# EAGLE design schemat (EAGLE 9.6.2)
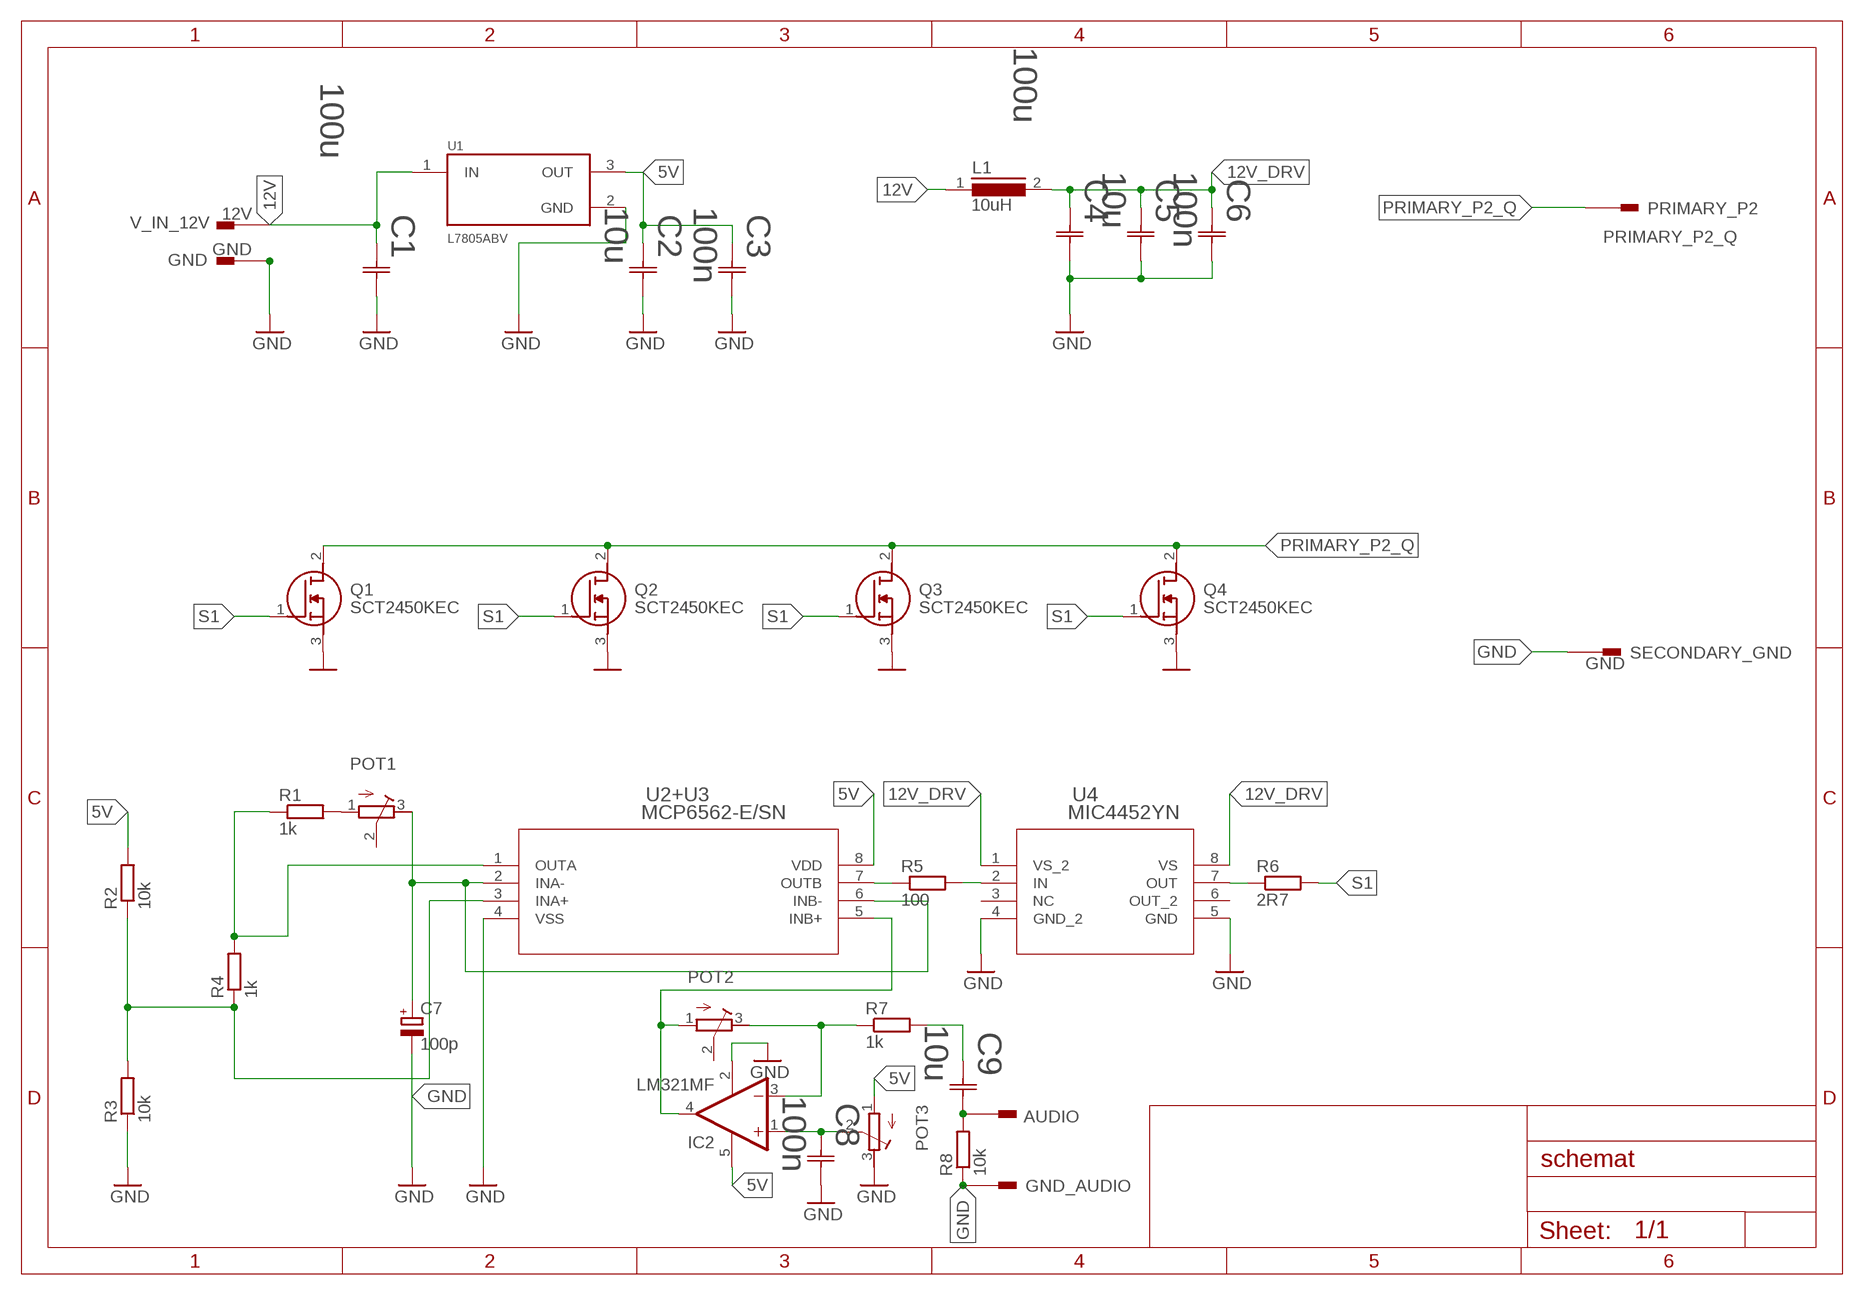
[diagram p0: schematic, sheet 1]

## Parts
AUDIO  PIN1-2  [62221]
C1  100u  35ZLH100MEFC6.3X11  [CAP_YX_6P3X11_RUB]
C2  10u  ECEA1EKS100  [CAP_5_X_5_PAN]
C3  100n  0402B104K250CT  [CAP_0402_WAL]
C4  100u  35ZLH100MEFC6.3X11  [CAP_YX_6P3X11_RUB]
C5  10u  ECEA1EKS100  [CAP_5_X_5_PAN]
C6  100n  0402B104K250CT  [CAP_0402_WAL]
C7  100p  CPOL-EUE1.8-4  [E1,8-4]
C8  100n  0402B104K250CT  [CAP_0402_WAL]
C9  10u  ECEA1EKS100  [CAP_5_X_5_PAN]
GND  GND  PIN1-2  [62221]
GND_AUDIO  GND  PIN1-2  [62221]
IC2  LM321MF  [SOT23-5]
L1  10uH  RKE4  [RKE4]
POT1  R-TRIMM64W  [RTRIM64W]
POT2  R-TRIMM64W  [RTRIM64W]
POT3  R-TRIMM64W  [RTRIM64W]
PRIMARY_P2  PRIMARY_P2_Q  PIN1-2  [62221]
Q1  SCT2450KEC  [TO545P521X1594X2583-3P]
Q2  SCT2450KEC  [TO545P521X1594X2583-3P]
Q3  SCT2450KEC  [TO545P521X1594X2583-3P]
Q4  SCT2450KEC  [TO545P521X1594X2583-3P]
R1  1k  R-EU_0204/7  [0204/7]
R2  10k  R-EU_0204/7  [0204/7]
R3  10k  R-EU_0204/7  [0204/7]
R4  1k  R-EU_0204/7  [0204/7]
R5  100  R-EU_0204/7  [0204/7]
R6  2R7  R-EU_0204/7  [0204/7]
R7  1k  R-EU_0204/7  [0204/7]
R8  10k  R-EU_0204/7  [0204/7]
SECONDARY_GND  GND  PIN1-2  [62221]
U1  L7805ABV  [TO254P460X1020X1945-3P]
U2+U3  MCP6562-E/SN  [SOIC8-N_MC_MCH]
U4  MIC4452YN  [PDIP8(N)_MCH]
V_IN_12V  12V  PIN1-2  [62221]

## Nets
5V: C2.1 C3.1 IC2.5(V+) POT3.1(A) R2.2 U1.3(OUT) U2+U3.8(VDD)
12V: C1.1 L1.1 U1.1(IN) V_IN_12V.1
12V_DRV: C4.1 C5.1 C6.1 L1.2 U4.1(VS_2) U4.8(VS)
12V_DRV1: C8.1 IC2.1(+IN) POT3.2(S)
GND: C1.2 C2.2 C3.2 C4.2 C5.2 C6.2 C7.- C8.2 GND.1 GND_AUDIO.1 IC2.2(V-) POT3.3(E) Q1.3(S) Q2.3(S) Q3.3(S) Q4.3(S) R3.1 R8.1 SECONDARY_GND.1 U1.2(GND) U2+U3.4(VSS) U4.4(GND_2) U4.5(GND)
N$1: R2.1 R3.2 R4.1 U2+U3.3(INA+)
N$2: R1.1 R4.2 U2+U3.1(OUTA)
N$3: POT1.1(A) R1.2
N$4: C7.+ POT1.3(E) U2+U3.2(INA-) U2+U3.6(INB-)
N$5: R5.1 U2+U3.7(OUTB)
N$6: R5.2 U4.2(IN)
N$7: R6.1 U4.7(OUT)
N$8: IC2.4(OUT) POT2.1(A) U2+U3.5(INB+)
N$9: C9.1 R7.2
N$10: IC2.3(-IN) POT2.3(E) R7.1
N$11: AUDIO.1 C9.2 R8.2
PRIMARY_P2_Q: PRIMARY_P2.1 Q1.2(D) Q2.2(D) Q3.2(D) Q4.2(D)
S1: Q1.1(G) Q2.1(G) Q3.1(G) Q4.1(G) R6.2
Unconnected: POT1.2(S) POT2.2(S) U4.3(NC) U4.6(OUT_2)

## Library data of the parts
AUDIO GND GND_AUDIO PRIMARY_P2 SECONDARY_GND V_IN_12V = con-faston:PIN1-2: CONN TAB FASTON BRASS .187 PCB TAB, FSSTON, DUAL STAKE, .187 SERIES Digi-Key Part Number: A24734CT-ND Source: Tyco Electronics Corporation .. ENG_CD_62221_R.pdf http://search.digikey.com/scripts/DkSearch/dksus.dll?Detail&name=A24734CT-ND; MF: TYCO ELECTRONICS; MPN: 62221-1; OC_FARNELL: unknown; OC_NEWARK: 16H2318
C1 C4 = 6_3x11:35ZLH100MEFC6.3X11; COPYRIGHT: Copyright (C) 2024 Ultra Librarian. All rights reserved.; MANUFACTURER_PART_NUMBER: 35ZLH100MEFC6.3X11; MFR_NAME: Rubycon
C2 C5 C9 = 10u:ECEA1EKS100; COPYRIGHT: Copyright (C) 2024 Ultra Librarian. All rights reserved.; MANUFACTURER_PART_NUMBER: ECEA1EKS100; MFR_NAME: Panasonic
C3 C6 C8 = 100n:0402B104K250CT; COPYRIGHT: Copyright (C) 2024 Ultra Librarian. All rights reserved.; MANUFACTURER_PART_NUMBER: 0402B104K250CT; MFR_NAME: Walsin
C7 = rcl:CPOL-EU: POLARIZED CAPACITOR, European symbol; SPICEPREFIX: C
IC2 = linear:LM321?*: Low Power Single Op Amp Source: http://cache.national.com/ds/LM/LM321.pdf
L1 = inductors:RKE4: INDUCTOR; SPICEPREFIX: L
POT1-POT3 = rcl:R-TRIMM: Trimm resistor; SPICEMODEL: X; SPICEPREFIXL: POT
Q1-Q4 = SCT2450KEC:SCT2450KEC: ROHM SCT2450KEC N-channel MOSFET Transistor, 10 A, 1200 V, 3-Pin TO-247 Source: Datasheet <https://datasheet.datasheetarchive.com/originals/distributors/Datasheets_SAMA/98bdb544f590089e014c21aaa2b32b5b.pdf>; DESCRIPTION: ROHM SCT2450KEC N-channel MOSFET Transistor, 10 A, 1200 V, 3-Pin TO-247; HEIGHT: 5.21mm; MANUFACTURER_NAME: ROHM Semiconductor; MANUFACTURER_PART_NUMBER: SCT2450KEC
R1-R8 = rcl:R-EU_: RESISTOR, European symbol; SPICEPREFIX: R
U1 = L7805ABV:L7805ABV: L7805 Series 1.5 A 5 V Three Terminal Voltage Regulator - TO-220 Check availability <https://pricing.snapeda.com/parts/L7805ABV/STMicroelectronics/view-part?ref=eda>; AVAILABILITY: In Stock; CHECK_PRICES: https://www.snapeda.com/parts/L7805ABV/STMicroelectronics/view-part/?ref=eda; DESCRIPTION: Linear Voltage Regulator IC Positive Fixed 1 Output 1.5A TO-220; MF: STMicroelectronics; MP: L7805ABV; PACKAGE: TO-220-3 STMicroelectronics; PRICE: None; PURCHASE-URL: https://www.snapeda.com/api/url_track_click_mouser/?unipart_id=4685&manufacturer=STMicroelectronics&part_name=L7805ABV&search_term=None; SNAPEDA_LINK: https://www.snapeda.com/parts/L7805ABV/STMicroelectronics/view-part/?ref=snap
U2+U3 = MCP6562-E_SN:MCP6562-E/SN; COPYRIGHT: Copyright (C) 2024 Ultra Librarian. All rights reserved.; MANUFACTURER_PART_NUMBER: mcp6562-e/sn; MFR_NAME: Microchip
U4 = MIC4452YN:MIC4452YN; COPYRIGHT: Copyright (C) 2024 Ultra Librarian. All rights reserved.; MANUFACTURER_PART_NUMBER: MIC4452YN; MFR_NAME: Micrel / Microchip Technology

## Board
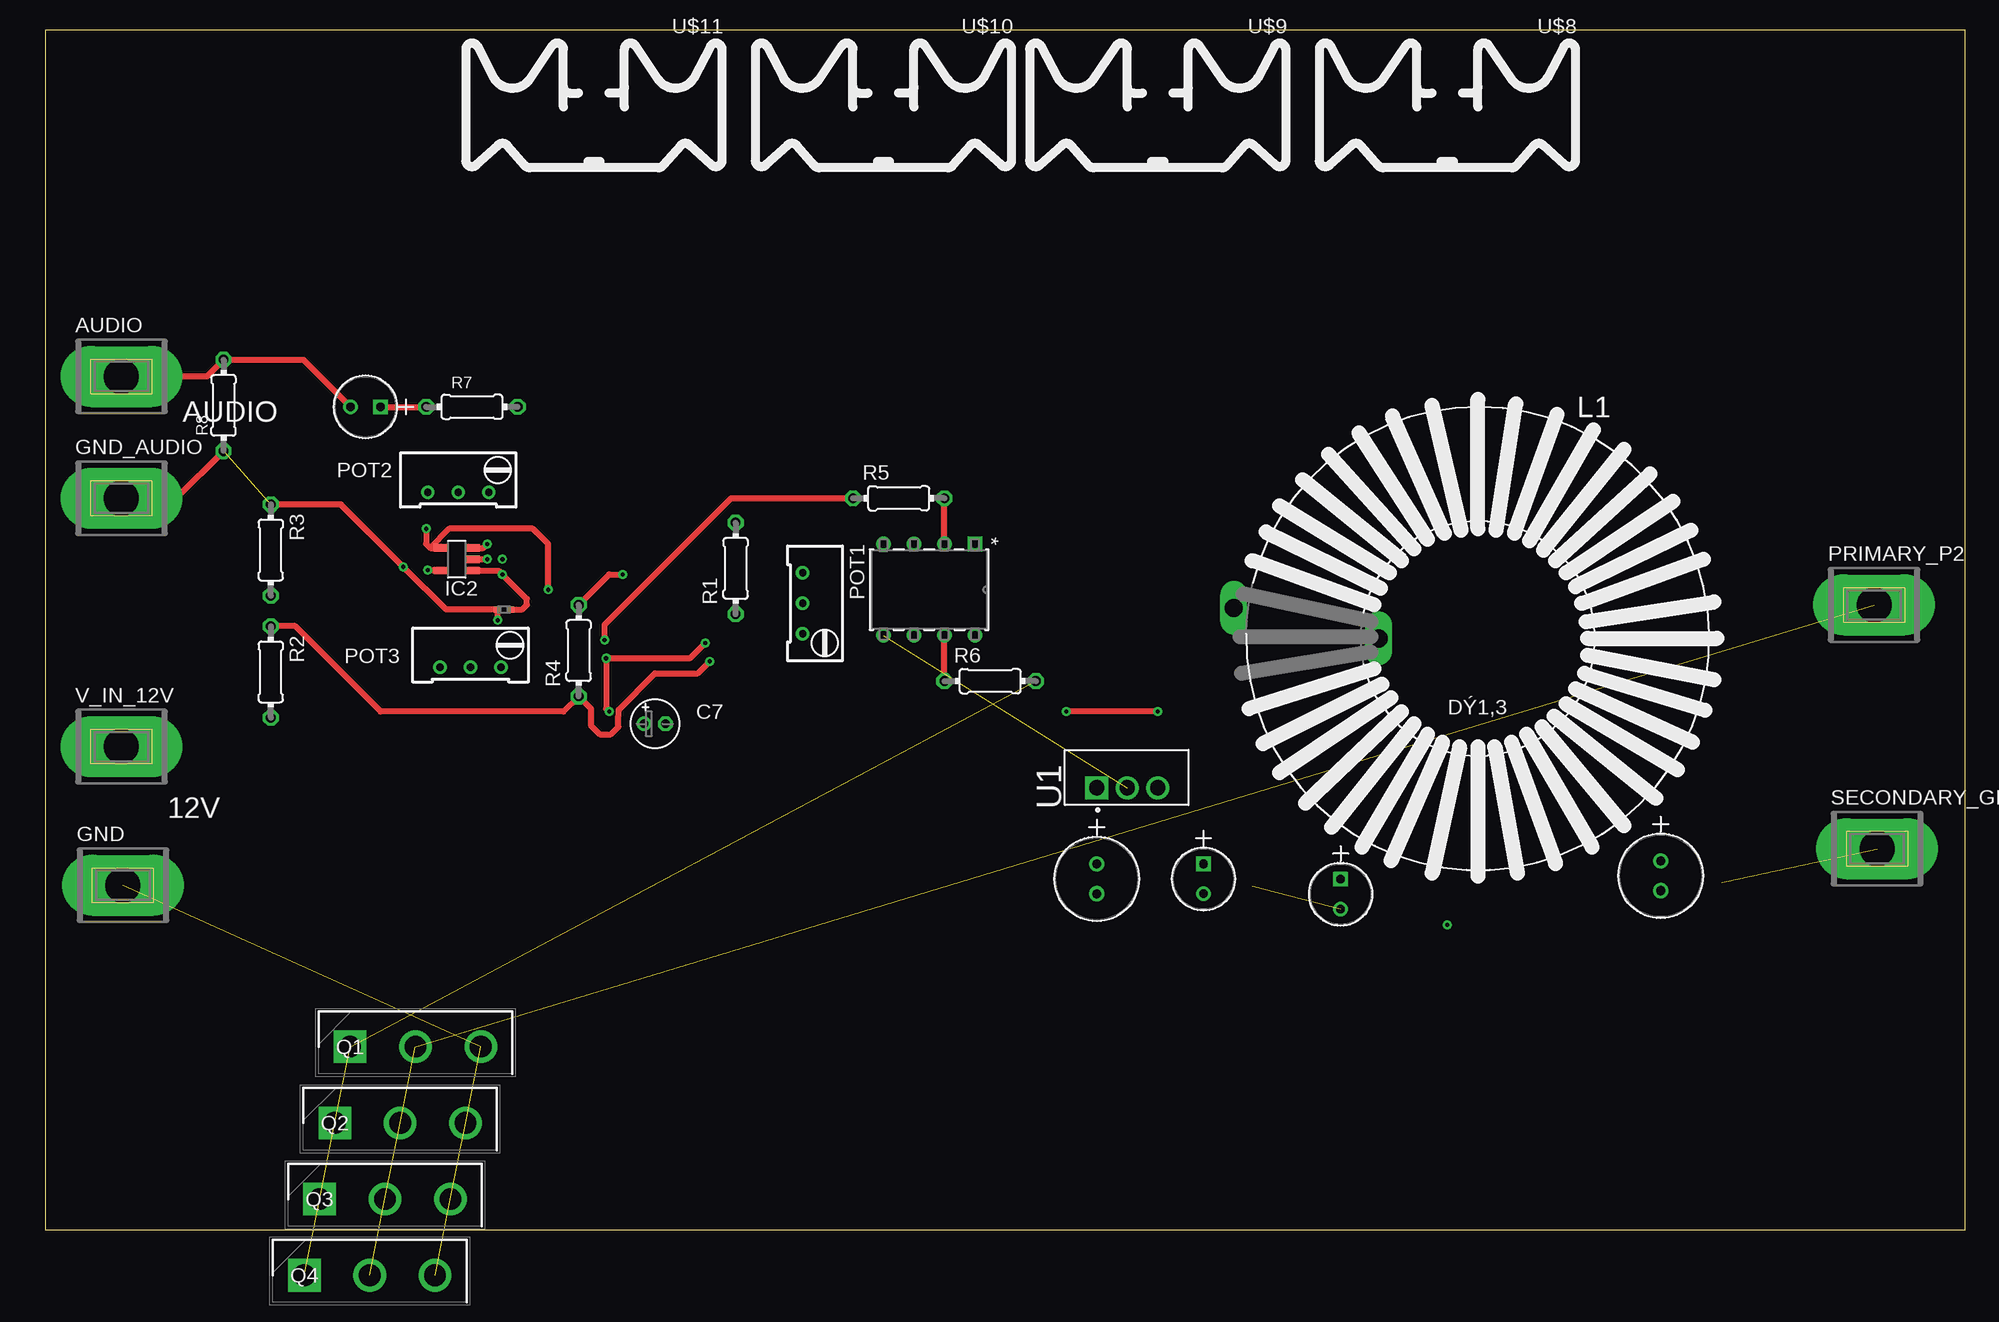
[diagram p1: board, top side]
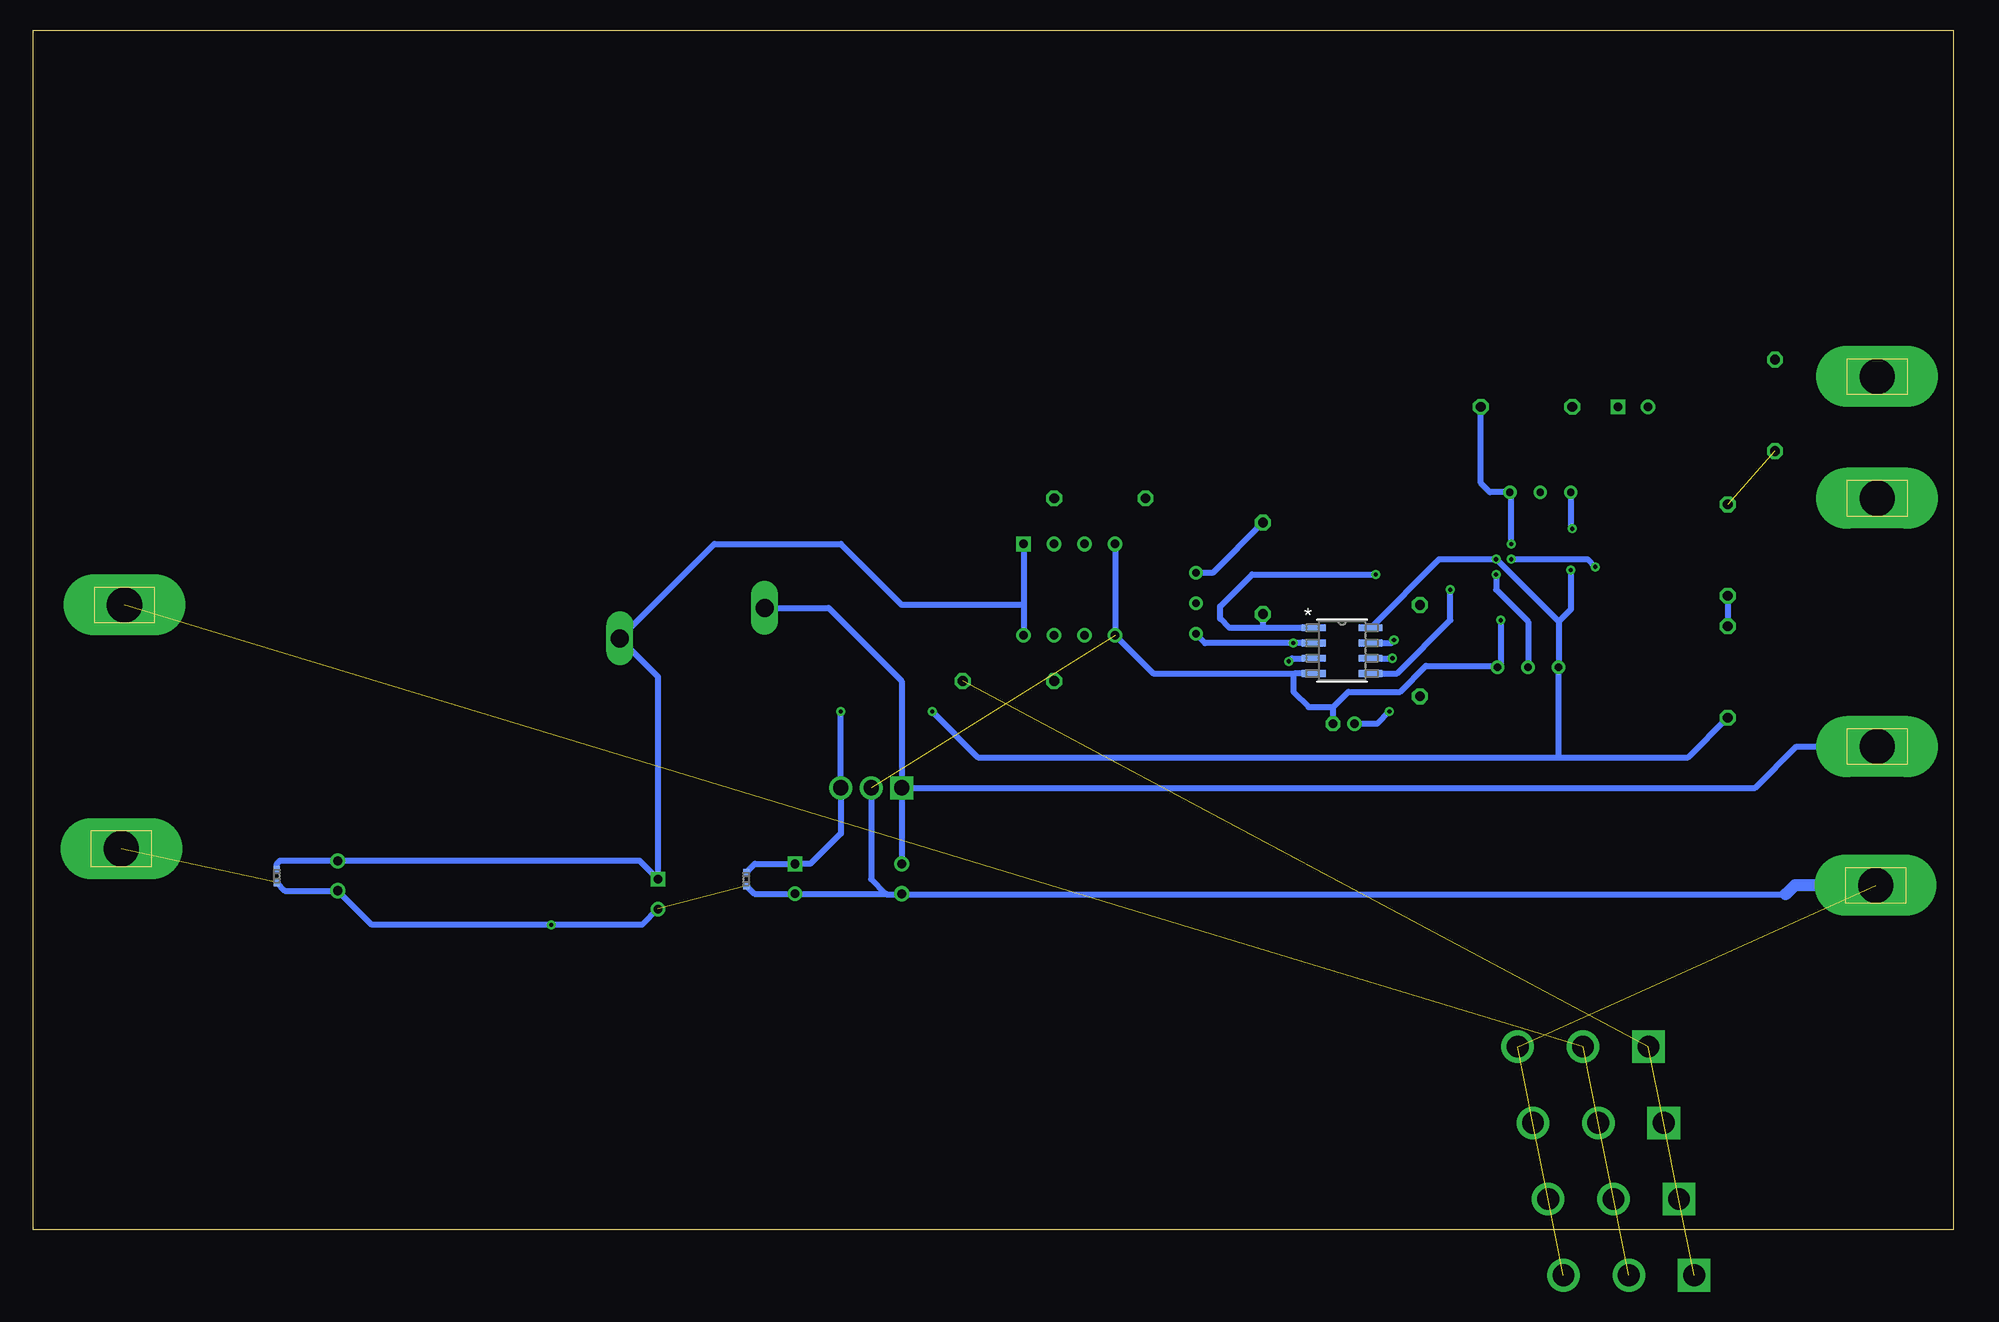
[diagram p2: board, bottom side, seen from below]

Size 160 x 100 mm. Coordinates in mm from the lower left corner, seen from the top.
Outline: 0,0 160,0 160,100 0,100 0,0
Copper layers (1*16): Top 0.035mm / dielectric 1.5mm / Bottom 0.035mm
Design rules "default": minimum track width 6mil, minimum drill 0.35mm, track to track 6mil, track to pad 6mil, pad to pad 6mil, via to via 6mil, smd to smd 6mil, copper to edge 40mil, drill to drill 6mil, minimum pad ring 10mil, minimum via ring 8mil, stop-mask expansion 4mil, vias tented up to drill 0mil, thermal gap 10mil

### Footprints (pad centres in the part's own frame; a part is rotated, then mirrored left to right if it is on the bottom)
62221 = drill 2.921 pad 5.08 long: 1 0,0
CAP_YX_6P3X11_RUB = drill 0.762 pad 1.27: 1 0,0; 2 2.489,0
CAP_5_X_5_PAN = drill 0.711 pad 1.219 square: 1 0,0 | drill 0.711 pad 1.219: 2 2.489,0
CAP_0402_WAL = smd 0.61 x 0.508: 1 -0.546,0; 2 0.546,0
E1,8-4 = drill 0.711 pad 1.168: + -0.889,0 | drill 0.711 pad 1.168 octagon: - 0.889,0
SOT23-5 = smd 0.6 x 1.2: 1 -0.95,-1.306; 2 0,-1.306; 3 0.95,-1.306; 4 0.95,1.306; 5 -0.95,1.306
RKE4 = drill 1.499 long: 1 -20.32,2.54; 2 -8.255,0
RTRIM64W = drill 0.61: 1 1.27,-2.54; 2 1.27,0; 3 1.27,2.54
TO545P521X1594X2583-3P = drill 1.81 pad 2.715 square: 1 0,0 | drill 1.81 pad 2.715: 2 5.45,0; 3 10.9,0
0204/7 = drill 0.813 octagon: 1 -3.81,0; 2 3.81,0
TO254P460X1020X1945-3P = drill 1.27 pad 1.91 square: 1 0,2.54 | drill 1.27 pad 1.91: 2 0,0; 3 0,-2.54
SOIC8-N_MC_MCH = smd 1.981 x 0.559: 1 -2.362,1.905; 2 -2.362,0.635; 3 -2.362,-0.635; 4 -2.362,-1.905; 5 2.362,-1.905; 6 2.362,-0.635; 7 2.362,0.635; 8 2.362,1.905
PDIP8(N)_MCH = drill 0.711 pad 1.219 square: 1 0,0 | drill 0.711 pad 1.219: 2 0,-2.54; 3 0,-5.08; 4 0,-7.62; 5 7.62,-7.62; 6 7.62,-5.08; 7 7.62,-2.54; 8 7.62,0

### Placement (x,y rotation side)
AUDIO  6.35,71.12 0 top
C1  87.63,30.48 270 top
C2  96.52,30.48 270 top
C3  100.58,29.21 270 bottom
C4  134.62,30.73 270 top
C5  107.95,29.21 270 top
C6  139.7,29.46 270 bottom
C7  50.8,42.16 0 top
C8  38.23,51.69 180 top
C9  27.94,68.58 180 top
GND  6.48,28.7 0 top
GND_AUDIO  6.35,60.96 0 top
IC2  34.29,55.88 90 top
L1  119.38,49.28 0 top
POT1  64.39,52.2 180 top
POT2  34.42,62.74 270 top
POT3  35.43,48.13 270 top
PRIMARY_P2  152.4,52.07 0 top
Q1  25.4,15.24 0 top
Q2  24.13,8.89 0 top
Q3  22.86,2.54 0 top
Q4  21.59,-3.81 0 top  (outside the outline)
R1  57.53,55.12 90 top
R2  18.8,46.48 270 top
R3  18.8,56.64 270 top
R4  44.45,48.26 90 top
R5  71.12,60.96 0 top
R6  78.74,45.72 0 top
R7  35.56,68.58 180 top
R8  14.86,68.71 90 top
SECONDARY_GND  152.65,31.75 0 top
U1  90.17,36.83 90 top
U2+U3  50.93,48.26 0 bottom
U4  77.47,57.15 270 top
U$8  [PF752]  116.84,88.9 180 top
U$9  [PF752]  92.71,88.9 180 top
U$10  [PF752]  69.85,88.9 180 top
U$11  [PF752]  45.72,88.9 180 top
V_IN_12V  6.35,40.26 0 top

### Tracks (layer width: path | path; a pad name or v marks a point on that pad's centre or on a via)
5V  (via drill 0.35)
  Top 0.508: v92.71,43.18 v85.09,43.18 | IC2.5 31.94,54.93 v31.88,54.99
  Bottom 0.508: C3.1 99.86,30.48 C2.1 95.25,30.48 92.71,33.02 U1.3 v92.71,43.18 | v85.09,43.18 81.28,39.37 33.02,39.37 | R2.2 22.1,39.37 33.02,39.37 | 32.89,50.67 POT3.1 32.89,39.5 33.02,39.37 | 32.89,50.67 v38.1,55.88 42.85,55.88 U2+U3.8 | v31.88,54.99 31.88,51.69 32.89,50.67
12V
  Bottom 0.508: L1.1 93.73,51.82 87.63,45.72 U1.1 | U1.1 16.51,36.83 13.08,40.26 V_IN_12V.1 | U1.1 C1.1
12V_DRV
  Bottom 0.508: U4.1 77.47,52.07 | 77.47,52.07 U4.8 | 77.47,52.07 87.63,52.07 92.71,57.15 103.25,57.15 L1.2 107.95,46.1 C5.1 109.47,30.73 C4.1 139.45,30.73 139.7,30.48 C6.1
12V_DRV1  (via drill 0.35)
  Top 0.508: IC2.1 37.78,54.93 v38.1,54.61 40.13,52.58 40.13,52.07 39.75,51.69 C8.1
  Bottom 0.508: v38.1,54.61 38.1,53.34 35.43,50.67 POT3.2
GND  (via drill 0.35)  (8 unrouted)
  Top 0.508: R8.1 10.92,60.96 GND_AUDIO.1 | R3.1 24.64,60.45 v29.84,55.24 33.4,51.69 C8.2 37.68,50.84 v37.72,50.8 | IC2.2 v36.83,55.88
  Bottom 0.508: 13.97,27.94 87.58,27.94 88.9,27.94 88.95,27.99 | U1.2 90.17,29.21 88.95,27.99 | 88.95,27.99 C2.2 99.91,27.99 C3.2 | U4.4 U4.5 66.67,46.35 54.86,46.35 | C6.2 139.03,28.25 C4.2 131.78,25.4 v116.84,25.4 109.27,25.4 C5.2 | v37.72,50.8 37.72,47.12 POT3.3 38.1,46.99 43.94,46.99 46.1,44.83 50.42,44.83 51.69,43.56 | U2+U3.4 54.86,46.35 | 54.86,46.35 54.99,46.23 54.99,44.83 53.72,43.56 51.69,43.56 | C7.- 51.69,43.56 | v29.84,55.24 30.48,55.88 v36.83,55.88
  Bottom 1.016: GND.1 13.21,28.7 13.97,27.94 | 87.58,27.94 C1.2
N$1  (via drill 0.35)
  Top 0.508: R2.1 20.83,50.29 27.94,43.18 43.18,43.18 R4.1 45.47,43.43 45.47,42.04 46.23,41.27 47.12,41.27 47.75,41.91 47.75,42.83 47.77,42.85 47.77,43.33 50.8,46.35 54.36,46.35 v55.37,47.37
  Bottom 0.508: R3.2 R2.1 | v55.37,47.37 55.12,47.62 U2+U3.3
N$2  (via drill 0.35)
  Top 0.508: R4.2 46.99,54.61 v48.13,54.61
  Bottom 0.508: U2+U3.1 57.53,50.16 | 57.53,50.16 60.33,50.16 61.09,50.93 61.09,51.94 58.42,54.61 v48.13,54.61 | R1.1 57.53,50.16
N$3
  Bottom 0.508: R1.2 61.72,54.74 POT1.1
N$4  (via drill 0.35)
  Top 0.508: v46.99,43.18 46.74,43.43 v46.74,47.62 53.72,47.62 v54.99,48.9
  Bottom 0.508: U2+U3.6 v46.74,47.62 | v46.99,43.18 48.01,42.16 C7.+ | U2+U3.2 v54.99,48.9 62.36,48.9 POT1.3
N$5  (via drill 0.35)
  Top 0.508: v46.61,49.15 46.61,50.42 57.15,60.96 R5.1
  Bottom 0.508: U2+U3.7 46.86,48.9 v46.61,49.15
N$6
  Top 0.508: U4.2 R5.2
N$7
  Top 0.508: R6.1 U4.7
N$8  (via drill 0.35)
  Top 0.508: v31.75,58.42 31.75,57.15 32.07,56.83 | 32.07,56.83 IC2.4 | v41.91,53.34 41.91,57.15 40.64,58.42 33.66,58.42 32.07,56.83
  Bottom 0.508: POT2.1 31.88,58.55 v31.75,58.42 | U2+U3.5 46.35,46.35 41.91,50.8 v41.91,53.34
N$9
  Top 0.508: C9.1 R7.2
N$10  (via drill 0.35)
  Top 0.508: IC2.3 36.51,56.83 v36.83,57.15
  Bottom 0.508: R7.1 39.37,62.23 38.61,61.47 POT2.3 36.83,61.34 v36.83,57.15
N$11
  Top 0.508: AUDIO.1 13.46,71.12 R8.2 21.51,72.52 C9.2
PRIMARY_P2_Q  (4 unrouted)
S1  (4 unrouted)

### Text on the board
tNames: AUDIO | 12V